# EAGLE design STM32F030 - VGA bare - v6 (EAGLE 7.2.0)
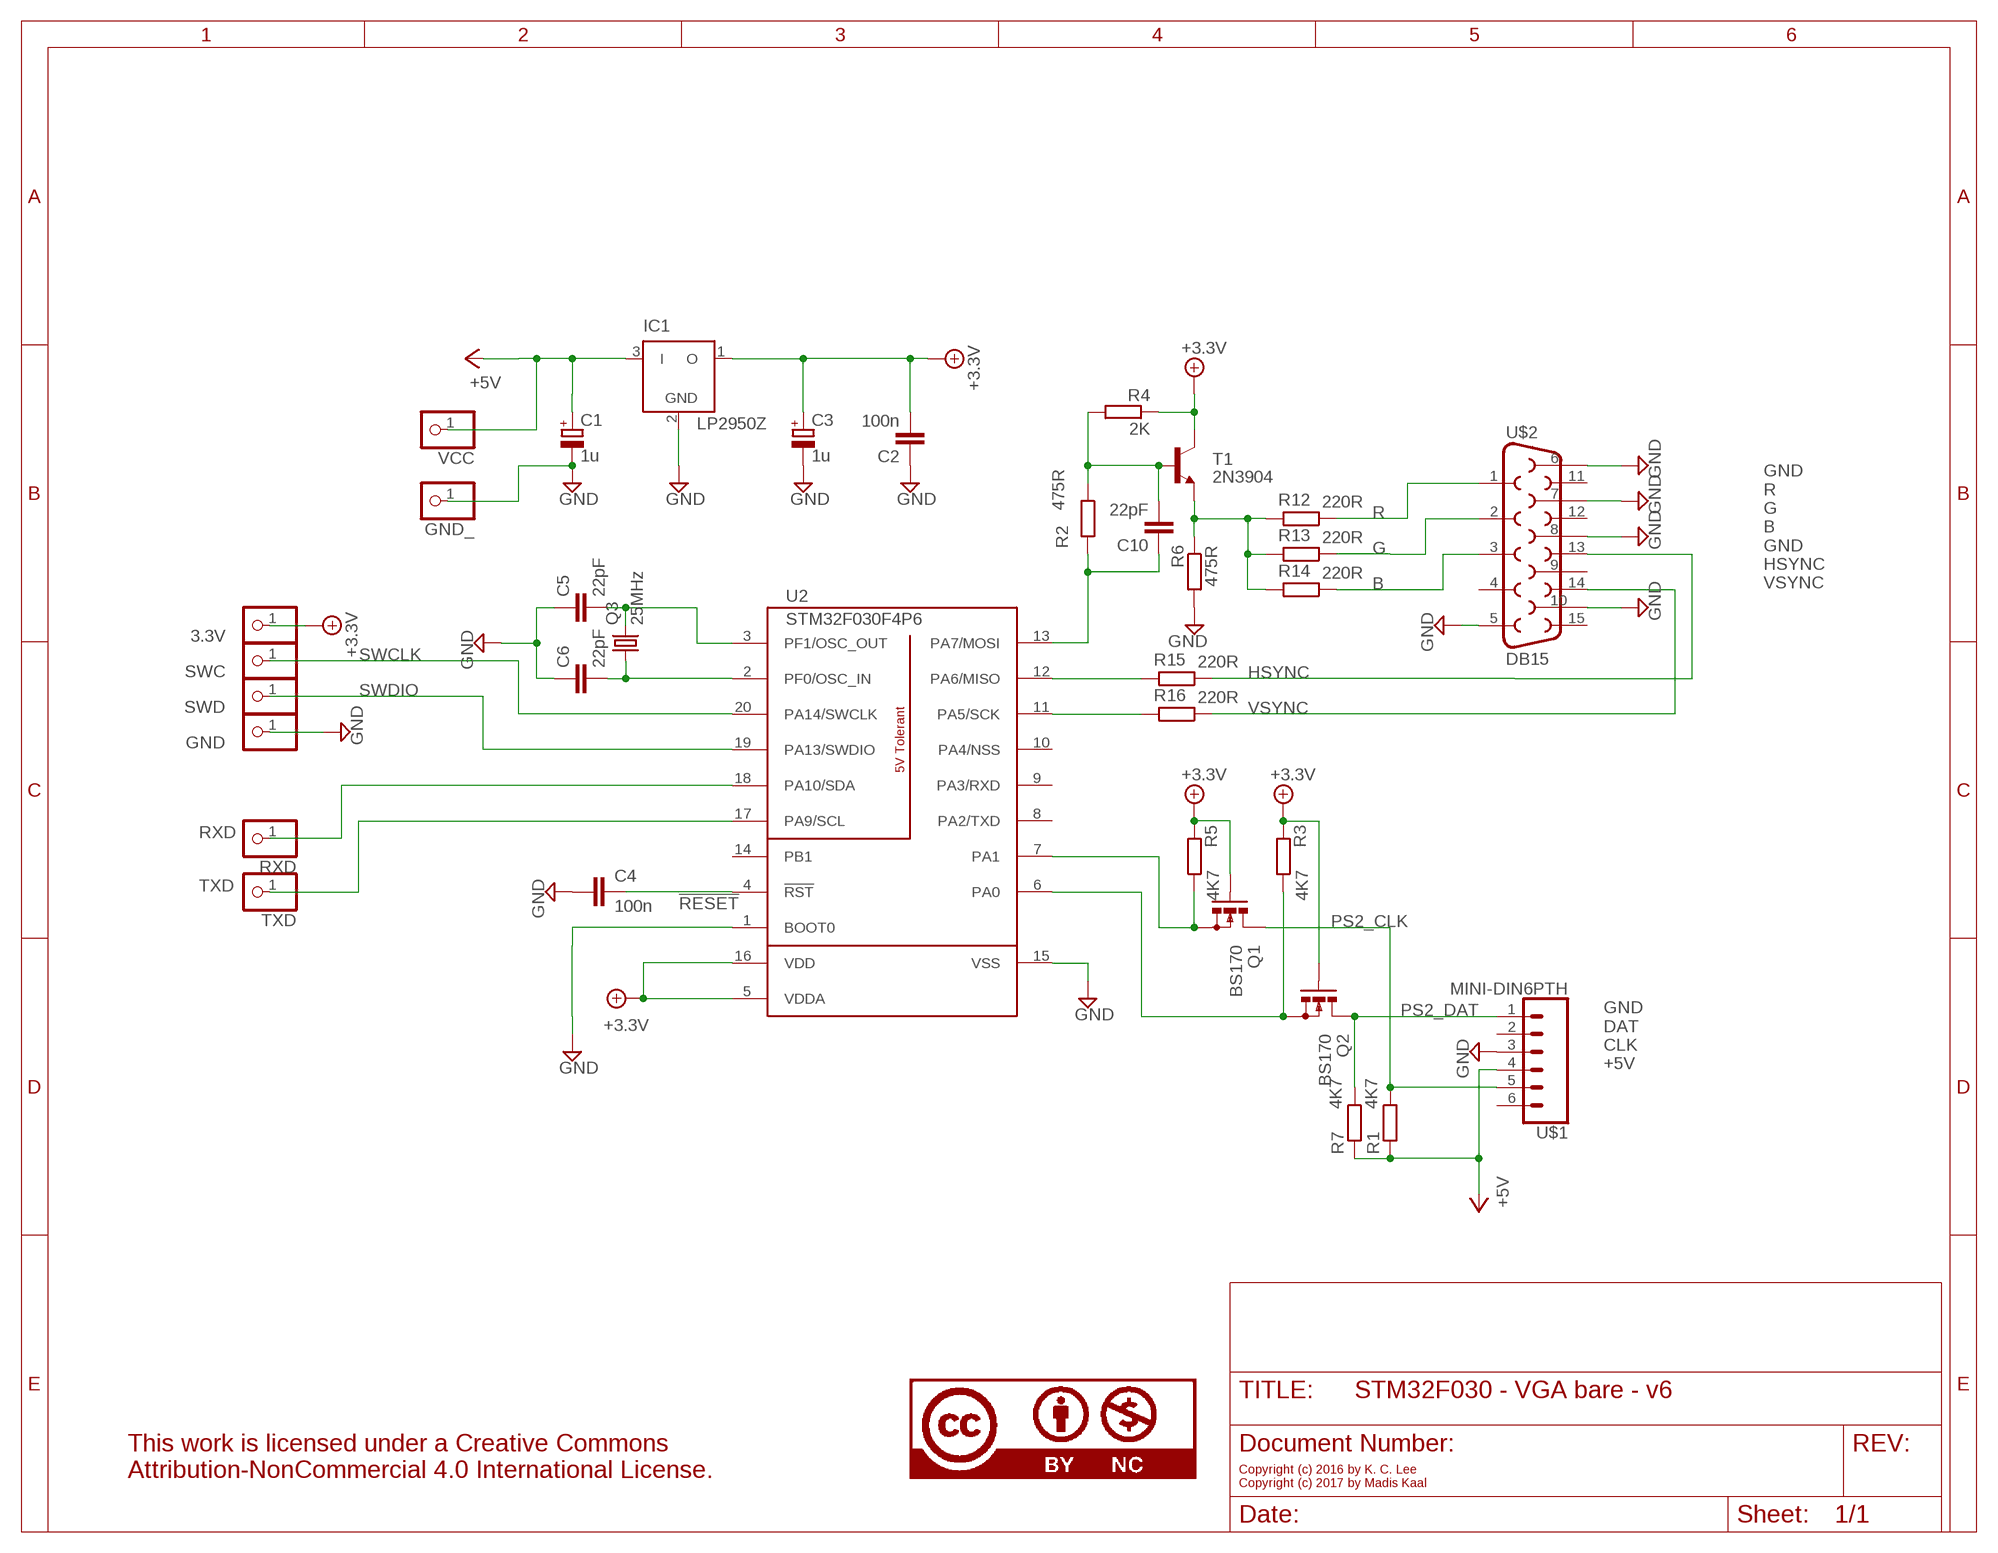
[diagram p0: schematic, sheet 1]

## Parts
3.3V  PINHD-1X1  [1X01]
C1  1u  CPOL-EUE2.5-5  [E2,5-5]
C2  100n  C-EU025-025X050  [C025-025X050]
C3  1u  CPOL-EUE2.5-5  [E2,5-5]
C4  100n  C-EU025-025X050  [C025-025X050]
C5  22pF  C-EU025-025X050  [C025-025X050]
C6  22pF  C-EU025-025X050  [C025-025X050]
C10  22pF  C-EU025-025X050  [C025-025X050]
GND  PINHD-1X1  [1X01]
GND_  PINHD-1X1  [1X01]
IC1  LP2950Z  [TO92]
LICENSE  CC-BY-NC  CC-BY-NC75%  [CC-BY-NC-75]
Q1  BS170  [SOT54E]
Q2  BS170  [SOT54E]
Q3  25MHz  CRYSTALHC49U-V  [HC49U-V]
R1  4K7  R-EU_0204/7  [0204/7]
R2  475R  R-EU_0204/7  [0204/7]
R3  4K7  R-EU_0204/7  [0204/7]
R4  2K  R-EU_0204/7  [0204/7]
R5  4K7  R-EU_0204/7  [0204/7]
R6  475R  R-EU_0204/7  [0204/7]
R7  4K7  R-EU_0204/7  [0204/7]
R12  220R  R-EU_0204/7  [0204/7]
R13  220R  R-EU_0204/7  [0204/7]
R14  220R  R-EU_0204/7  [0204/7]
R15  220R  R-EU_0204/7  [0204/7]
R16  220R  R-EU_0204/7  [0204/7]
RXD  PINHD-1X1  [1X01]
SWC  PINHD-1X1  [1X01]
SWD  PINHD-1X1  [1X01]
T1  2N3904  [TO92]
TXD  PINHD-1X1  [1X01]
U2  STM32F030F4P6  [TSSOP20]
U$1  MINI-DIN6PTH  [MINI-DIN6]
U$2  DB15  [DB15]
VCC  PINHD-1X1  [1X01]

## Nets
!RESET: C4.1 U2.4(!RST)
+3.3V: 3.3V.1 C2.2 C3.+ IC1.1(O) Q1.G Q2.G R3.2 R4.1 R5.2 T1.1(C) U2.5(VDDA) U2.16(VDD)
+5V: C1.+ IC1.3(I) R1.2 R7.2 U$1.4 VCC.1
B: R14.1 U$2.3
G: R13.1 U$2.2
GND: C1.- C2.1 C3.- C4.2 C5.1 C6.1 GND.1 GND_.1 IC1.2(GND) R6.2 U2.1(BOOT0) U2.15(VSS) U$1.3 U$2.5 U$2.6 U$2.7 U$2.8 U$2.10
HSYNC: R15.1 U$2.13
N$1: R6.1 R12.2 R13.2 R14.2 T1.3(E)
N$2: R15.2 U2.12(PA6/MISO)
N$4: Q1.S R5.1 U2.7(PA1)
N$5: C5.2 Q3.2 U2.3(PF1/OSC_OUT)
N$6: C6.2 Q3.1 U2.2(PF0/OSC_IN)
N$7: Q2.S R3.1 U2.6(PA0)
N$8: R16.2 U2.11(PA5/SCK)
N$11: C10.2 R2.1 R4.2 T1.2(B)
N$12: C10.1 R2.2 U2.13(PA7/MOSI)
PS2_CLK: Q1.D R1.1 U$1.5
PS2_DAT: Q2.D R7.1 U$1.1
R: R12.1 U$2.1
RXD: RXD.1 U2.18(PA10/SDA)
SWCLK: SWC.1 U2.20(PA14/SWCLK)
SWDIO: SWD.1 U2.19(PA13/SWDIO)
TXD: TXD.1 U2.17(PA9/SCL)
VSYNC: R16.1 U$2.14
Unconnected: U2.8(PA2/TXD) U2.9(PA3/RXD) U2.10(PA4/NSS) U2.14(PB1) U$1.2 U$1.6 U$2.4 U$2.9 U$2.11 U$2.12 U$2.15

## Notes on the sheet
- GND
  R
  G
  B
  GND
  HSYNC
  VSYNC
- GND
  DAT
  CLK
  +5V
- Copyright (c) 2016 by K. C. Lee
  Copyright (c) 2017 by Madis Kaal

## Library data of the parts
3.3V GND GND_ RXD SWC SWD TXD VCC = pinhead:PINHD-1X1: PIN HEADER
C1 C3 = rcl:CPOL-EU: POLARIZED CAPACITOR, European symbol
C2 C4 = rcl:C-EU: CAPACITOR, European symbol; PARTNO: 0.1UF, 0603
C5 C6 C10 = rcl:C-EU: CAPACITOR, European symbol; PARTNO: 22PF, 0603
IC1 = linear:LP2950: 100 mA, Low Power Low Dropout Voltage Regulator Source: http://www.onsemi.com/pub/Collateral/LP2950-D.PDF
LICENSE = Misc logo:CC-BY-NC; PARTNO: LICENSE
Q1 Q2 = transistor-small-signal:BS170: N-CHANNEL MOS FET
Q3 = crystal:CRYSTAL: CRYSTAL
R1 R3 R5 R7 = resistor:R-EU_: RESISTOR, European symbol; PARTNO: 4K7, 0603
R2 R6 = resistor:R-EU_: RESISTOR, European symbol; PARTNO: 475R, 0603
R4 = resistor:R-EU_: RESISTOR, European symbol; PARTNO: 2K, 0603
R12-R16 = resistor:R-EU_: RESISTOR, European symbol
T1 = transistor:2N3904: NPN TRANSISTOR
U2 = Misc Processor:STM32F030F4P6; PARTNO: STM32F030F4P6
U$1 = SparkFun-Retired:MINI-DIN6: Mini DIN 6 Connector SparkFun used to sell this connector and has used it on a couple designs, however the connector and the designs are now retired. Mini DIN 6 Connector [RETIRED] <https://www.sparkfun.com/products/retired/8509> SparkFun Key Counter - PS2 [RETIRED] <https://www.sparkfun.com/products/retired/8652> Commonly found on the back of a computer for PS2 keyboard and mice. Schematic and footprint are proven.
U$2 = SparkFun-Retired:DB15: DB15 / VGA right angle through-hole female connector.

## Board
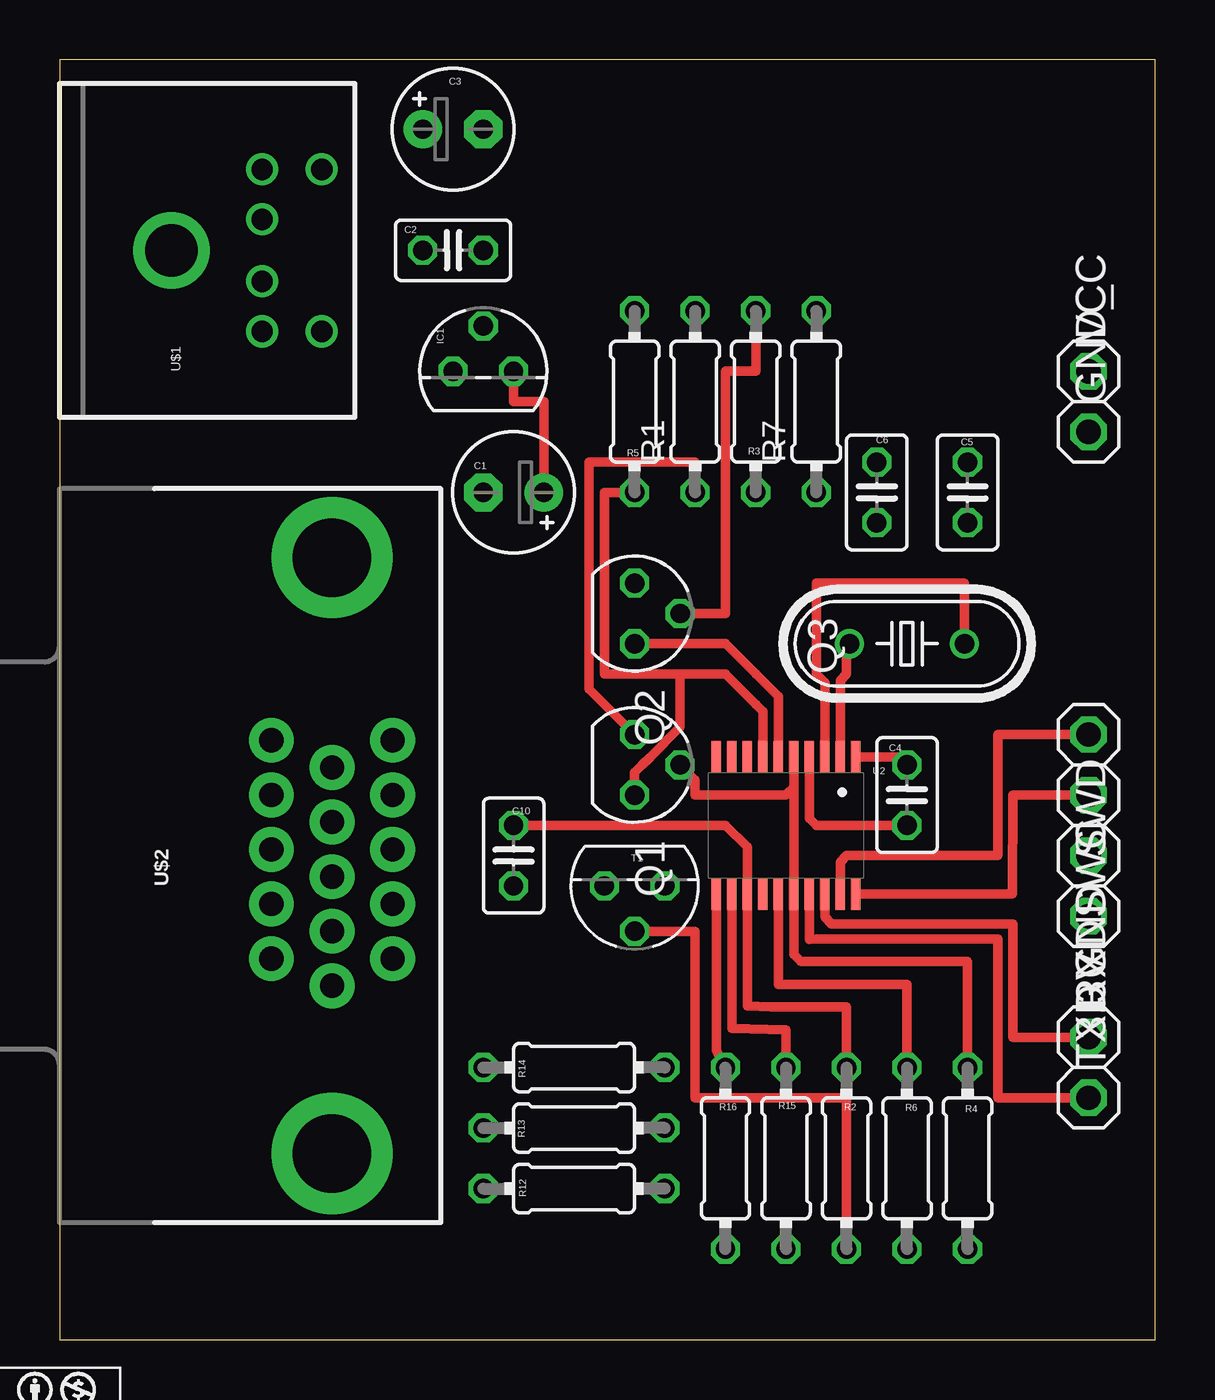
[diagram p1: board, top side]
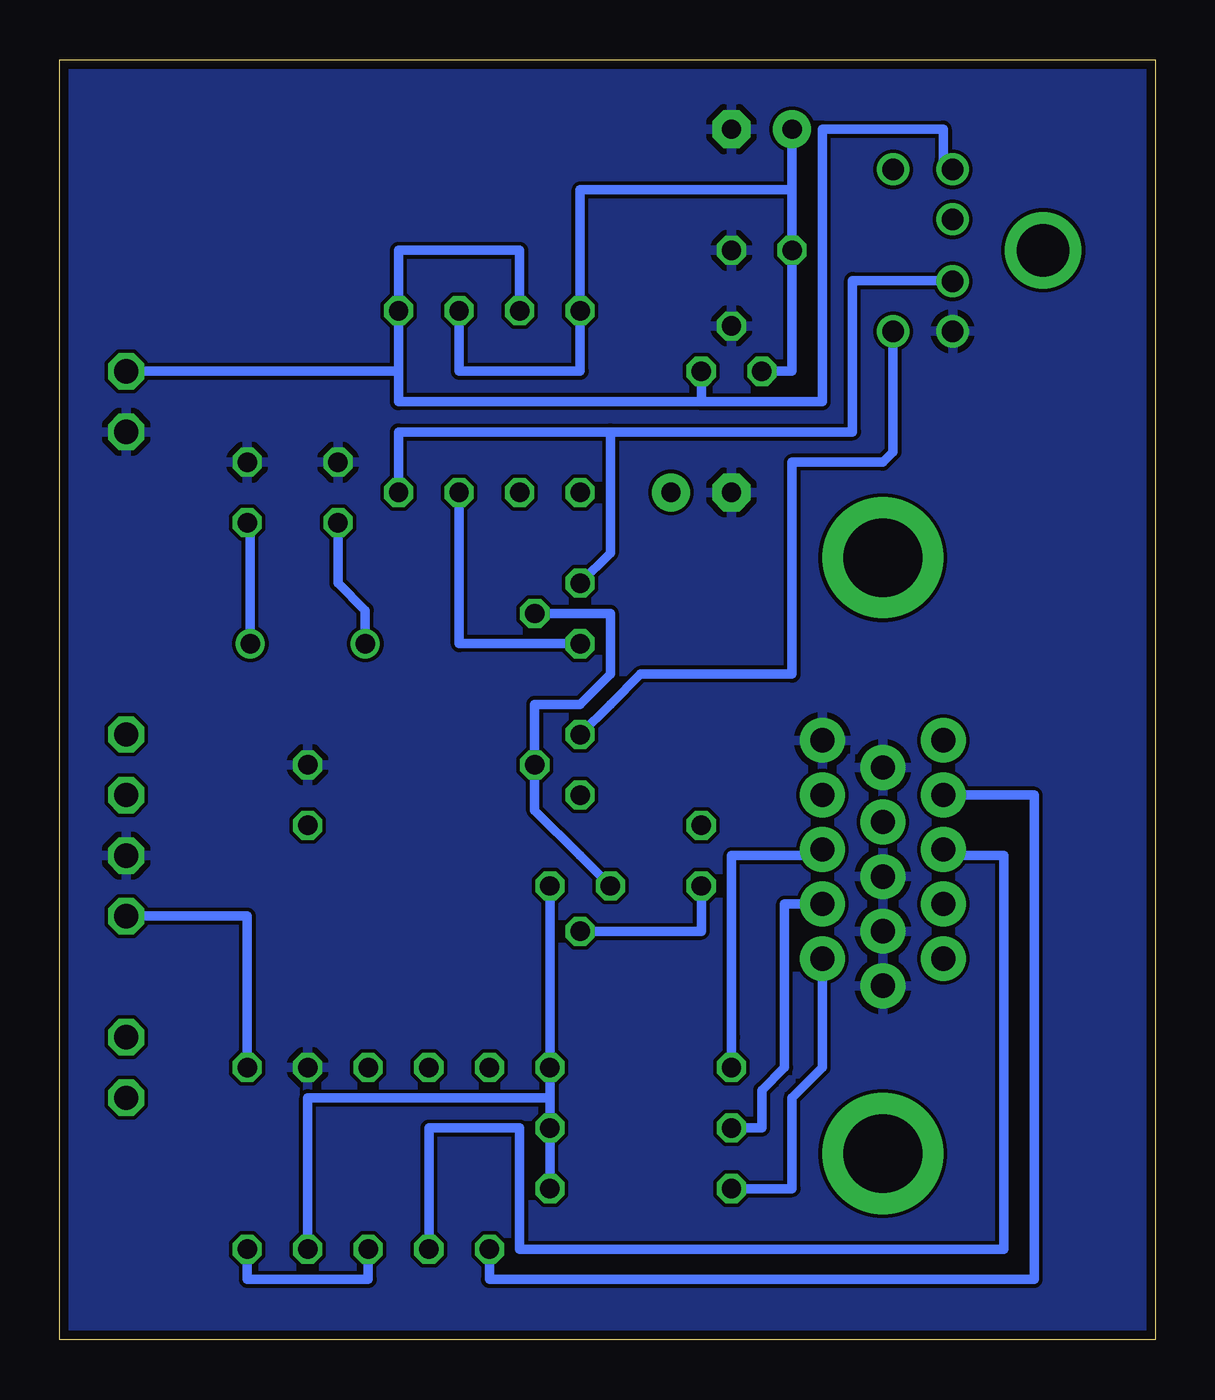
[diagram p2: board, bottom side, seen from below]

Size 45.97 x 53.72 mm. Coordinates in mm from the lower left corner, seen from the top.
Outline: 0,0 45.97,0 45.97,53.72 0,53.72 0,0
Copper layers (1*16): Top 0.0356mm / dielectric 1.5011mm / Bottom 0.0356mm
Design rules "oshpark-2layer": minimum track width 6mil, minimum drill 13mil, track to track 6mil, track to pad 6mil, pad to pad 6mil, via to via 6mil, smd to smd 6mil, copper to edge 15mil, drill to drill 6mil, minimum pad ring 7mil, minimum via ring 7mil, stop-mask expansion 4mil, vias tented up to drill 0mil, thermal gap 10mil

### Footprints (pad centres in the part's own frame; a part is rotated, then mirrored left to right if it is on the bottom)
1X01 = drill 1.016 octagon: 1 0,0
E2,5-5 = drill 0.813 pad 1.6: + -1.27,0 | drill 0.813 pad 1.6 octagon: - 1.27,0
C025-025X050 = drill 0.813 octagon: 1 -1.27,0; 2 1.27,0
TO92 = drill 0.813 octagon: 1 -1.27,0; 2 0,1.905; 3 1.27,0
SOT54E = drill 0.813 octagon: D -1.27,0; G 0,1.905; S 1.27,0
HC49U-V = drill 0.813: 1 -2.413,0; 2 2.413,0
0204/7 = drill 0.813 octagon: 1 -3.81,0; 2 3.81,0
TO92' = drill 0.813 octagon: 1 1.27,0; 2 0,1.905; 3 -1.27,0
TSSOP20 = smd 0.4 x 1.35: 1 -2.925,-2.875; 2 -2.275,-2.875; 3 -1.625,-2.875; 4 -0.975,-2.875; 5 -0.325,-2.875; 6 0.325,-2.875; 7 0.975,-2.875; 8 1.625,-2.875; 9 2.275,-2.875; 10 2.925,-2.875; 11 2.925,2.875; 12 2.275,2.875; 13 1.625,2.875; 14 0.975,2.875; 15 0.325,2.875; 16 -0.325,2.875; 17 -0.975,2.875; 18 -1.625,2.875; 19 -2.275,2.875; 20 -2.925,2.875
MINI-DIN6 = drill 0.9: 1 -1.3,-8.5; 2 1.3,-8.5; 3 -3.4,-8.5; 4 3.4,-8.5; 5 -3.4,-11; 6 3.4,-11 | drill 2.2: P$1 0,-4.7
DB15 = drill 1.016 pad 1.88: 1 -4.32,-7.62; 2 -2.03,-7.62; 3 0.26,-7.62; 4 2.55,-7.62; 5 4.84,-7.62; 6 -5.46,-5.08; 7 -3.17,-5.08; 8 -0.88,-5.08; 9 1.41,-5.08; 10 3.7,-5.08; 11 -4.32,-2.54; 12 -2.03,-2.54; 13 0.26,-2.54; 14 2.55,-2.54; 15 4.84,-2.54 | drill 3.302 pad 5.08: G1 -12.5,-5.08; G2 12.5,-5.08

### Placement (x,y rotation side)
3.3V  43.18,17.78 0 top
C1  19.05,35.56 180 top
C2  16.51,45.72 180 top
C3  16.51,50.8 0 top
C4  35.56,22.86 90 top
C5  38.1,35.56 270 top
C6  34.29,35.56 270 top
C10  19.05,20.32 270 top
GND  43.18,20.32 0 top
GND_  43.18,38.1 0 top
IC1  17.78,40.64 0 top
LICENSE  -5.08,-3.81 0 top  (outside the outline)
Q1  24.13,24.13 270 top
Q2  24.13,30.48 270 top
Q3  35.56,29.21 0 top
R1  26.67,39.37 90 top
R2  33.02,7.62 90 top
R3  29.21,39.37 90 top
R4  38.1,7.62 270 top
R5  24.13,39.37 90 top
R6  35.56,7.62 90 top
R7  31.75,39.37 90 top
R12  21.59,6.35 0 top
R13  21.59,8.89 0 top
R14  21.59,11.43 0 top
R15  30.48,7.62 90 top
R16  27.94,7.62 90 top
RXD  43.18,12.7 0 top
SWC  43.18,22.86 0 top
SWD  43.18,25.4 0 top
T1  2N3904  [TO92']  24.13,19.05 180 top
TXD  43.18,10.16 0 top
U2  30.48,21.59 180 top
U$1  0,45.72 90 top
U$2  6.35,20.32 90 top
VCC  43.18,40.64 0 top

### Tracks (layer width: path | path; a pad name or v marks a point on that pad's centre or on a via)
!RESET
  Top 0.406: U2.4 31.45,21.89 31.75,21.59 C4.1
+3.3V
  Top 0.406: R4.1 38.1,15.88 31.11,15.88 30.8,16.18 U2.16 U2.5 30.8,23.18 30.48,22.86 26.67,22.86 26.67,23.5 Q1.G | R3.2 29.21,40.64 27.94,40.64 27.94,34.29 27.94,33.02 27.94,30.48 Q2.G
  Bottom 0.406: C3.+ 15.24,48.26 | 15.24,48.26 C2.2 15.24,40.64 IC1.1 | 15.24,48.26 24.13,48.26 R5.2 24.13,40.64 29.21,40.64 R3.2 | 3.3V.1 38.1,17.78 R4.1 | T1.1 24.13,20.32 26.04,22.23 Q1.G 26.04,26.67 24.13,26.67 22.86,27.94 22.86,30.48 Q2.G
+5V
  Top 0.406: C1.+ 20.32,39.37 19.05,39.37 IC1.3
  Bottom 0.406: R1.2 26.67,45.72 31.75,45.72 R7.2 31.75,40.64 | VCC.1 31.75,40.64 | 19.05,39.37 IC1.3 19.05,39.37 | 19.05,39.37 31.75,39.37 31.75,40.64 | 19.05,39.37 13.97,39.37 13.97,50.8 8.89,50.8 8.89,49.51 U$1.4
B
  Bottom 0.406: R14.1 17.78,12.7 17.78,20.32 14.23,20.32 U$2.3
G
  Bottom 0.406: R13.1 16.51,8.89 16.51,10.48 15.56,11.43 15.56,18.29 U$2.2
GND
  Top 0.406: U2.1 35.23,24.46 C4.2 | U2.15 30.16,15.25 30.16,14.92 35.56,14.92 R6.2
  pour Bottom: 45.72,53.34 0,53.34 0,0 45.72,0
HSYNC
  Bottom 0.406: R15.1 30.48,8.89 26.67,8.89 26.67,3.81 6.35,3.81 6.35,20.32 8.63,20.32 U$2.13
N$1
  Bottom 0.406: R6.1 35.56,10.16 25.4,10.16 R13.2 | R13.2 R14.2 T1.3 | R12.2 R13.2
N$2
  Top 0.406: U2.12 28.2,15.61 28.2,13.07 30.48,13.02 R15.2
N$4
  Top 0.406: U2.7 29.5,26.38 29.21,26.67 27.94,27.94 26.04,27.94 | 26.04,27.94 22.86,27.94 22.86,35.56 R5.1 | Q1.S 24.13,23.81 24.45,24.13 24.77,24.45 26.04,25.72 26.04,27.94
N$5
  Top 0.406: U2.3 32.1,27.59 31.75,27.94 31.75,31.75 37.97,31.75 Q3.2
  Bottom 0.406: Q3.2 37.97,34.16 C5.2
N$6
  Top 0.406: U2.2 32.76,27.68 33.02,27.94 33.02,29.08 Q3.1
  Bottom 0.406: Q3.1 33.15,30.61 34.29,31.75 C6.2
N$7
  Top 0.406: U2.6 30.16,27 29.21,27.94 27.94,29.21 Q2.S
  Bottom 0.406: Q2.S 29.21,29.21 R3.1
N$8
  Top 0.406: U2.11 27.55,12.13 R16.2
N$11
  Top 0.406: R2.1 33.02,10.16 26.67,10.16 26.67,12.7 26.67,17.14 T1.2
  Bottom 0.406: T1.2 19.05,17.14 C10.2 | R4.2 38.1,2.54 33.02,2.54 R2.1
N$12
  Top 0.406: R2.2 33.02,13.97 29.84,13.97 28.86,14.01 U2.13 28.86,20.68 27.94,21.59 C10.1
PS2_CLK
  Top 0.406: R1.1 26.67,36.83 22.23,36.83 22.23,27.3 Q1.D
  Bottom 0.406: U$1.5 11,37.26 11.43,36.83 15.24,36.83 15.24,27.94 21.59,27.94 22.86,26.67 Q1.D
PS2_DAT
  Bottom 0.406: R7.1 31.75,38.1 22.86,38.1 | 22.86,38.1 22.86,33.02 Q2.D | 22.86,38.1 12.7,38.1 12.7,44.45 8.53,44.45 U$1.1
R
  Bottom 0.406: R12.1 15.24,6.35 15.24,10.16 13.97,11.43 U$2.1
RXD
  Top 0.406: U2.18 32.1,17.74 32.38,17.46 40.01,17.46 40.01,16.51 40.01,12.7 RXD.1
SWCLK
  Top 0.406: U2.20 39.99,18.71 40.01,22.86 SWC.1
SWDIO
  Top 0.406: U2.19 32.76,20.05 33.02,20.32 39.37,20.32 39.37,25.4 SWD.1
TXD
  Top 0.406: U2.17 31.45,16.8 31.75,16.83 39.37,16.83 39.37,10.16 TXD.1
VSYNC
  Bottom 0.406: R16.1 27.94,2.54 5.08,2.54 5.08,22.86 U$2.14